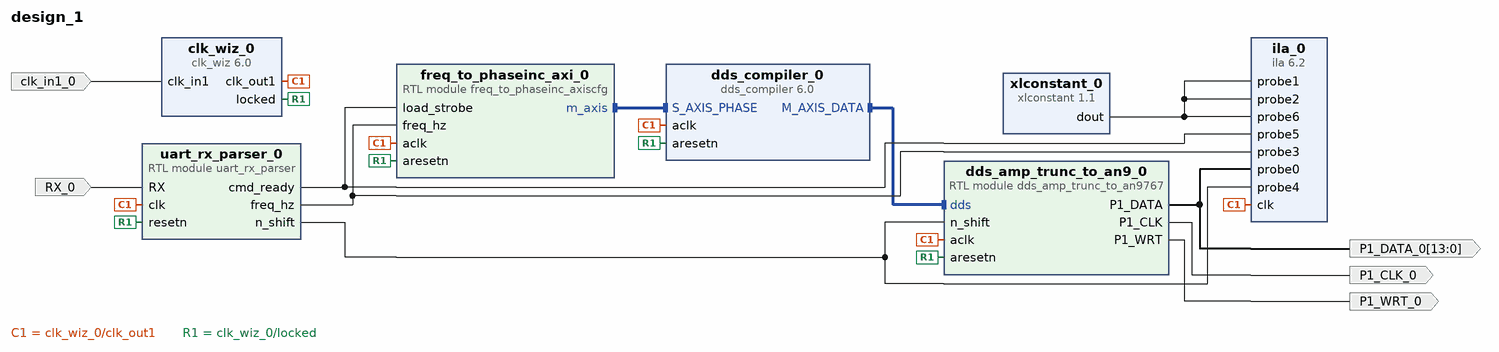
[diagram p0: block diagram of the top level]
# Vivado block design design_1, xc7z020clg400-2, Vivado 2024.2
create_bd_design design_1

create_bd_port -dir I RX_0
create_bd_port -dir I -type clk clk_in1_0
set_property -dict {CONFIG.FREQ_HZ 50000000} [get_bd_ports clk_in1_0]
create_bd_port -dir O P1_WRT_0
create_bd_port -dir O -type clk P1_CLK_0
set_property -dict {CONFIG.FREQ_HZ 125000000} [get_bd_ports P1_CLK_0]
create_bd_port -dir O -from 13 -to 0 P1_DATA_0

create_bd_cell -type ip -vlnv xilinx.com:ip:dds_compiler:6.0 dds_compiler_0
set_property -dict [list \
  CONFIG.DATA_Has_TLAST Not_Required \
  CONFIG.DDS_Clock_Rate 125 \
  CONFIG.Has_ARESETn true \
  CONFIG.Has_Phase_Out false \
  CONFIG.Latency 8 \
  CONFIG.M_DATA_Has_TUSER Not_Required \
  CONFIG.Noise_Shaping None \
  CONFIG.Output_Frequency1 0 \
  CONFIG.Output_Selection Sine \
  CONFIG.Output_Width 16 \
  CONFIG.PINC1 0 \
  CONFIG.Parameter_Entry Hardware_Parameters \
  CONFIG.PartsPresent Phase_Generator_and_SIN_COS_LUT \
  CONFIG.Phase_Increment Streaming \
  CONFIG.Phase_Width 48 \
  CONFIG.Phase_offset Fixed \
  CONFIG.S_PHASE_Has_TUSER Not_Required \
] [get_bd_cells dds_compiler_0]
create_bd_cell -type ip -vlnv xilinx.com:ip:clk_wiz:6.0 clk_wiz_0
set_property -dict [list \
  CONFIG.CLKIN1_JITTER_PS 200.0 \
  CONFIG.CLKOUT1_JITTER 154.207 \
  CONFIG.CLKOUT1_PHASE_ERROR 164.985 \
  CONFIG.CLKOUT1_REQUESTED_OUT_FREQ 125.000 \
  CONFIG.MMCM_CLKFBOUT_MULT_F 20.000 \
  CONFIG.MMCM_CLKIN1_PERIOD 20.000 \
  CONFIG.MMCM_CLKIN2_PERIOD 10.0 \
  CONFIG.MMCM_CLKOUT0_DIVIDE_F 8.000 \
  CONFIG.PRIM_IN_FREQ 50.000 \
  CONFIG.USE_RESET false \
] [get_bd_cells clk_wiz_0]
create_bd_cell -type ip -vlnv xilinx.com:ip:ila:6.2 ila_0
set_property -dict [list \
  CONFIG.ALL_PROBE_SAME_MU true \
  CONFIG.C_DATA_DEPTH 16384 \
  CONFIG.C_ENABLE_ILA_AXI_MON false \
  CONFIG.C_MONITOR_TYPE Native \
  CONFIG.C_NUM_OF_PROBES 7 \
] [get_bd_cells ila_0]
create_bd_cell -type module -reference uart_rx_parser uart_rx_parser_0
set_property -dict {CONFIG.CLK_FREQ 125000000} [get_bd_cells uart_rx_parser_0]
create_bd_cell -type ip -vlnv xilinx.com:ip:xlconstant:1.1 xlconstant_0
create_bd_cell -type module -reference dds_amp_trunc_to_an9767 dds_amp_trunc_to_an9_0
create_bd_cell -type module -reference freq_to_phaseinc_axiscfg freq_to_phaseinc_axi_0
set_property -dict {CONFIG.DDS_CLK_HZ 125000000} [get_bd_cells freq_to_phaseinc_axi_0]

# ---- connections ----

connect_bd_intf_net [get_bd_intf_pins dds_compiler_0/M_AXIS_DATA] [get_bd_intf_pins dds_amp_trunc_to_an9_0/dds]
connect_bd_intf_net [get_bd_intf_pins freq_to_phaseinc_axi_0/m_axis] [get_bd_intf_pins dds_compiler_0/S_AXIS_PHASE]
connect_bd_net -net RX_0_1 [get_bd_ports RX_0] [get_bd_pins uart_rx_parser_0/RX]
connect_bd_net -net clk_in1_0_1 [get_bd_ports clk_in1_0] [get_bd_pins clk_wiz_0/clk_in1]
connect_bd_net -net clk_wiz_clk_out1 [get_bd_pins clk_wiz_0/clk_out1] \
  [get_bd_pins uart_rx_parser_0/clk] [get_bd_pins dds_amp_trunc_to_an9_0/aclk] [get_bd_pins freq_to_phaseinc_axi_0/aclk] \
  [get_bd_pins dds_compiler_0/aclk] [get_bd_pins ila_0/clk]
connect_bd_net -net clk_wiz_locked [get_bd_pins clk_wiz_0/locked] \
  [get_bd_pins uart_rx_parser_0/resetn] [get_bd_pins dds_amp_trunc_to_an9_0/aresetn] \
  [get_bd_pins freq_to_phaseinc_axi_0/aresetn] [get_bd_pins dds_compiler_0/aresetn]
connect_bd_net [get_bd_pins dds_amp_trunc_to_an9_0/P1_CLK] [get_bd_ports P1_CLK_0]
connect_bd_net [get_bd_pins dds_amp_trunc_to_an9_0/P1_DATA] [get_bd_ports P1_DATA_0] [get_bd_pins ila_0/probe0]
connect_bd_net [get_bd_pins dds_amp_trunc_to_an9_0/P1_WRT] [get_bd_ports P1_WRT_0]
connect_bd_net [get_bd_pins uart_rx_parser_0/cmd_ready] [get_bd_pins freq_to_phaseinc_axi_0/load_strobe] [get_bd_pins ila_0/probe5]
connect_bd_net [get_bd_pins uart_rx_parser_0/freq_hz] [get_bd_pins freq_to_phaseinc_axi_0/freq_hz] [get_bd_pins ila_0/probe3]
connect_bd_net [get_bd_pins uart_rx_parser_0/n_shift] [get_bd_pins dds_amp_trunc_to_an9_0/n_shift] [get_bd_pins ila_0/probe4]
connect_bd_net [get_bd_pins xlconstant_0/dout] [get_bd_pins ila_0/probe1] [get_bd_pins ila_0/probe2] [get_bd_pins ila_0/probe6]

validate_bd_design
save_bd_design
